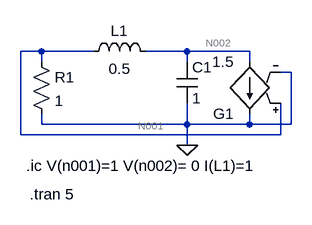
[diagram p0: schematic B35.asc]
B35.asc, the LTspice schematic file:
Version 4
SHEET 1 880 680
WIRE 32 80 0 80
WIRE 112 80 32 80
WIRE 256 80 192 80
WIRE 352 80 256 80
WIRE 32 96 32 80
WIRE 256 96 256 80
WIRE 352 96 352 80
WIRE 416 112 400 112
WIRE 32 192 32 176
WIRE 256 192 256 160
WIRE 256 192 32 192
WIRE 352 192 352 176
WIRE 352 192 256 192
WIRE 416 192 416 112
WIRE 416 192 352 192
WIRE 0 208 0 80
WIRE 400 208 400 160
WIRE 400 208 0 208
WIRE 256 224 256 192
FLAG 256 224 0
SYMBOL res 16 80 R0
SYMATTR InstName R1
SYMATTR Value 1
SYMBOL ind 96 96 R270
WINDOW 0 32 56 VTop 2
WINDOW 3 5 56 VBottom 2
SYMATTR InstName L1
SYMATTR Value 0.5
SYMBOL cap 240 96 R0
SYMATTR InstName C1
SYMATTR Value 1
SYMBOL g 352 192 R180
SYMATTR InstName G1
SYMATTR Value 1.5
TEXT 8 256 Left 2 !.ic V(n001)=1 V(n002)= 0 I(L1)=1
TEXT 14 300 Left 2 !.tran 5

The netlist it stands for:
* B35.asc
R1 N001 0 1
L1 N001 N002 0.5
C1 N002 0 1
G1 N002 0 N001 0 1.5
.ic V(n001)=1 V(n002)= 0 I(L1)=1
.tran 5
.backanno
.end